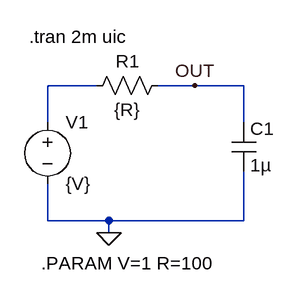
[diagram p0: schematic Fig_3-29_PARAM_C-R.asc]
Fig_3-29_PARAM_C-R.asc, the LTspice schematic file:
Version 4
SHEET 1 880 680
WIRE 176 80 112 80
WIRE 304 80 256 80
WIRE 368 80 304 80
WIRE 112 128 112 80
WIRE 368 128 368 80
WIRE 112 256 112 208
WIRE 192 256 112 256
WIRE 368 256 368 192
WIRE 368 256 192 256
WIRE 192 272 192 256
FLAG 192 272 0
FLAG 304 80 OUT
SYMBOL voltage 112 112 R0
WINDOW 123 0 0 Left 2
WINDOW 39 0 0 Left 2
SYMATTR InstName V1
SYMATTR Value {V}
SYMBOL cap 352 128 R0
SYMATTR InstName C1
SYMATTR Value 1µ
SYMBOL res 160 96 R270
WINDOW 0 32 56 VTop 2
WINDOW 3 0 56 VBottom 2
SYMATTR InstName R1
SYMATTR Value {R}
TEXT 88 16 Left 2 !.tran 2m uic
TEXT 104 312 Left 2 !.PARAM V=1 R=100

The netlist it stands for:
* Fig_3-29_PARAM_C-R.asc
V1 N001 0 {V}
C1 OUT 0 1µ
R1 N001 OUT {R}
.tran 2m uic
.PARAM V=1 R=100
.backanno
.end